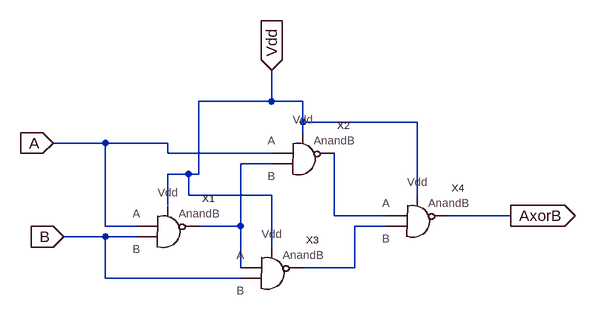
[diagram p0: schematic XOR.asc]
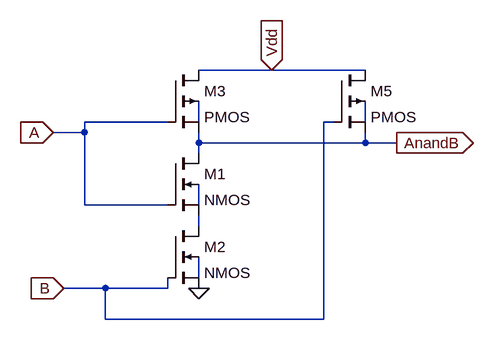
[diagram p1: sub-circuit nand.asc]
XOR.asc, the LTspice schematic file:
Version 4
SHEET 1 1324 680
WIRE 112 -256 112 -304
WIRE 112 -256 0 -256
WIRE 160 -256 112 -256
WIRE 160 -224 160 -256
WIRE 336 -224 160 -224
WIRE 160 -208 160 -224
WIRE -144 -192 -224 -192
WIRE -48 -192 -144 -192
WIRE -48 -176 -48 -192
WIRE 112 -176 -48 -176
WIRE 112 -160 64 -160
WIRE -16 -144 -48 -144
WIRE 0 -144 0 -256
WIRE 0 -144 -16 -144
WIRE -16 -112 -16 -144
WIRE 112 -112 -16 -112
WIRE 336 -112 336 -224
WIRE -48 -96 -48 -144
WIRE 208 -80 208 -176
WIRE 288 -80 208 -80
WIRE 480 -80 384 -80
WIRE -144 -64 -144 -192
WIRE -96 -64 -144 -64
WIRE 64 -64 64 -160
WIRE 64 -64 0 -64
WIRE 288 -64 240 -64
WIRE -144 -48 -208 -48
WIRE -96 -48 -144 -48
WIRE 112 -32 112 -112
WIRE 64 0 64 -64
WIRE 240 0 240 -64
WIRE 240 0 160 0
WIRE -144 16 -144 -48
WIRE 64 16 -144 16
FLAG -224 -192 A
IOPIN -224 -192 In
FLAG -208 -48 B
IOPIN -208 -48 In
FLAG 112 -304 Vdd
IOPIN 112 -304 In
FLAG 480 -80 AxorB
IOPIN 480 -80 Out
SYMBOL NAND 0 -16 R0
SYMATTR InstName X1
SYMBOL NAND 208 -128 R0
SYMATTR InstName X2
SYMBOL NAND 160 48 R0
SYMATTR InstName X3
SYMBOL NAND 384 -32 R0
SYMATTR InstName X4

nand.asc, the sub-circuit schematic file:
Version 4
SHEET 1 880 680
WIRE 256 16 144 16
WIRE 400 16 256 16
WIRE 96 96 -32 96
WIRE 144 96 144 64
WIRE 352 96 336 96
WIRE 400 96 400 64
WIRE -32 112 -32 96
WIRE -32 112 -80 112
WIRE 144 128 144 112
WIRE 400 128 400 112
WIRE 400 128 144 128
WIRE 448 128 400 128
WIRE 144 144 144 128
WIRE -32 224 -32 112
WIRE 96 224 -32 224
WIRE 144 224 144 192
WIRE 144 256 144 240
WIRE 144 336 144 304
WIRE 0 352 -64 352
WIRE 96 352 96 336
WIRE 96 352 0 352
WIRE 0 400 0 352
WIRE 336 400 336 96
WIRE 336 400 0 400
FLAG 144 352 0
FLAG 448 128 AnandB
IOPIN 448 128 Out
FLAG -80 112 A
IOPIN -80 112 In
FLAG -64 352 B
IOPIN -64 352 In
FLAG 256 16 Vdd
IOPIN 256 16 In
SYMBOL nmos4 96 144 R0
SYMATTR InstName M1
SYMATTR Value2 l=2 w=10
SYMBOL nmos4 96 256 R0
SYMATTR InstName M2
SYMATTR Value2 l=2 w=10
SYMBOL pmos4 96 16 R0
SYMATTR InstName M3
SYMATTR Value2 l=2 w=10
SYMBOL pmos4 352 16 R0
SYMATTR InstName M5
SYMATTR Value2 l=2 w=10

The netlist it stands for:
* XOR.asc
XX1 A B N001 Vdd nand
XX2 A N001 N002 Vdd nand
XX3 N001 B N003 Vdd nand
XX4 N002 N003 AxorB Vdd nand

* block symbol definitions
.subckt nand A B AnandB Vdd
M1 AnandB A N004 N003 NMOS l=2 w=10
M2 N004 B 0 N005 NMOS l=2 w=10
M3 Vdd A AnandB N001 PMOS l=2 w=10
M5 Vdd B AnandB N002 PMOS l=2 w=10
.ends nand

.model NMOS NMOS
.model PMOS PMOS
.lib standard.mos
.backanno
.end